# EasyEDA schematic SCH_ppc_2025-05-21.json
TITLE: Sheet_1; REV: 1.0; Date: 2025-05-20; Sheet: 1/1; Company: Your Company
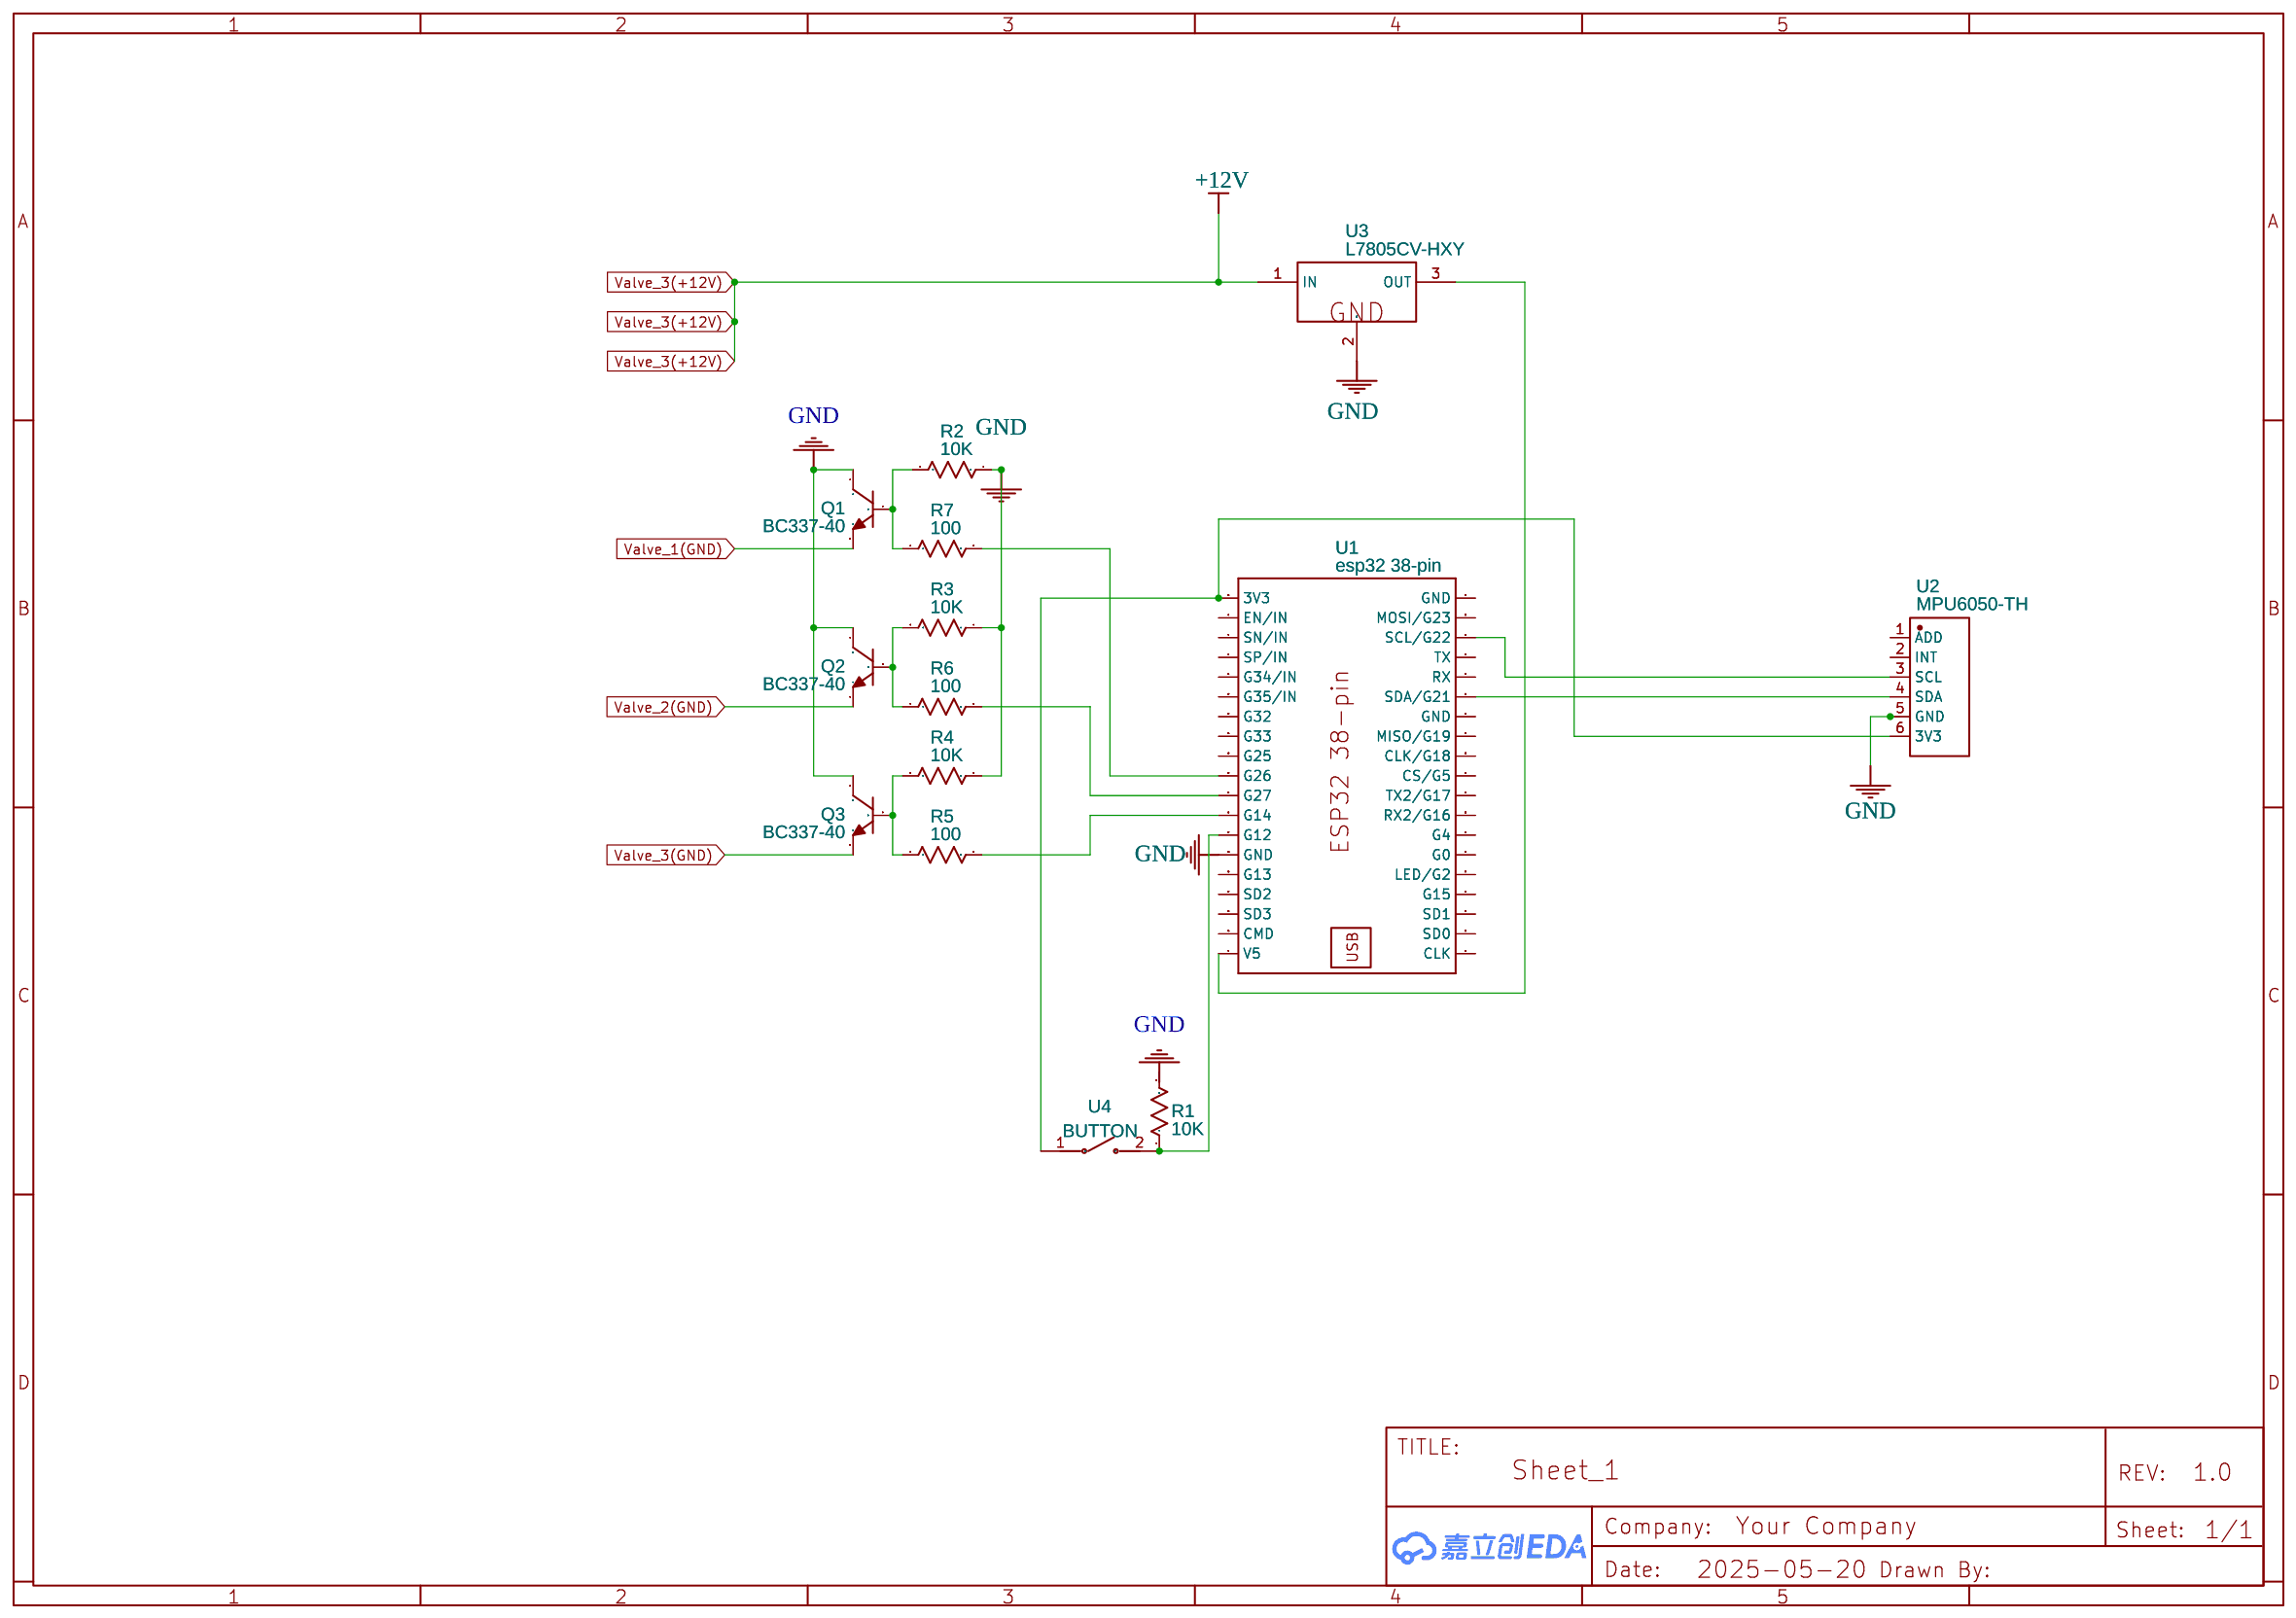
[diagram p0: schematic sheet]

## Parts
Q1  BC337-40  [TO-92-3_L4.9-W3.7-P1.27-L]
Q2  BC337-40  [TO-92-3_L4.9-W3.7-P1.27-L]
Q3  BC337-40  [TO-92-3_L4.9-W3.7-P1.27-L]
R1  10K  [PKG-0.25W RESISTOR]
R2  10K  [PKG-0.25W RESISTOR]
R3  10K  [PKG-0.25W RESISTOR]
R4  10K  [PKG-0.25W RESISTOR]
R5  100  [PKG-0.25W RESISTOR]
R6  100  [PKG-0.25W RESISTOR]
R7  100  [PKG-0.25W RESISTOR]
U1  esp32 38-pin  [ESP32 38-PIN]
U2  MPU6050-TH  [COMM-TH_MPU6050-TH]
U3  L7805CV-HXY  [TO-220-3_L10.0-W4.5-P2.54-L]
U4  BUTTON  [SW-SMD_L3.9-W2.9-LS4.9-L]

## Library data of the parts
Q1-Q3 = BC337-40: Contributor: LCSC; Supplier: LCSC; Supplier Part: C713611; Manufacturer: LGE(鲁光); JLCPCB Part Class: Extended Part
R1-R4 = 10K: Power: 1/4W; Tolerance: ±5%; Supplier Part: 9339116; Supplier: Element14; Manufacturer: MULTICOMP; Manufacturer Part: MCF 0.25W 10K; Link: http://www.farnell.com/datasheets/1716725.pdf?_ga=2.130313612.2023696496.1506695686-238689616.1505921947&_gac=1.45287312.1506011718.EAIaIQobChMI57GX6tq21gIVTzobCh2WXgT2EAAYASAAEgKn9_D_BwE; Contributor: Prof. Ing. F. Scordino
R5-R7 = 100: Power: 1/4W; Tolerance: ±5%; Supplier Part: 9339116; Supplier: Element14; Manufacturer: MULTICOMP; Manufacturer Part: MCF 0.25W 10K; Link: http://www.farnell.com/datasheets/1716725.pdf?_ga=2.130313612.2023696496.1506695686-238689616.1505921947&_gac=1.45287312.1506011718.EAIaIQobChMI57GX6tq21gIVTzobCh2WXgT2EAAYASAAEgKn9_D_BwE; Contributor: nurohman
U1 = esp32 38-pin: Supplier: self; Contributor: saadmuhammad262
U2 = MPU6050-TH: Supplier: LCSC; Supplier Part: C9900132629; Manufacturer: null; Contributor: lcsc
U3 = L7805CV-HXY: Contributor: lcsc; Supplier: LCSC; Supplier Part: C7469132; Manufacturer: HXY MOSFET(华轩阳电子); JLCPCB Part Class: Extended Part
U4 = BUTTON: Contributor: lcsc; Supplier: LCSC; Supplier Part: C9900015607; Manufacturer: null; JLCPCB Part Class: Extended Part

## Nets
+12V: U3.1(IN)
GND: Q1.1(C) Q2.1(C) Q3.1(C) R1.2 R2.1 R3.1 R4.1 U1.GND2(GND) U2.5(GND) U3.2(GND)
Valve_1(GND): Q1.3(E)
Valve_2(GND): Q2.3(E)
Valve_3(GND): Q3.3(E)
Net-(Q1-2): Q1.2(B) R2.2 R7.1
Net-(Q2-2): Q2.2(B) R3.2 R6.1
Net-(Q3-2): Q3.2(B) R4.2 R5.1
Net-(R1-1): R1.1 U1.D12(G12) U4.2
Net-(R5-2): R5.2 U1.D14(G14)
Net-(R6-2): R6.2 U1.D27(G27)
Net-(R7-2): R7.2 U1.D26(G26)
Net-(U1-3V3): U1.3V3 U2.6(3V3) U4.1
Net-(U1-D21): U1.D21(SDA/G21) U2.4(SDA)
Net-(U1-D22): U1.D22(SCL/G22) U2.3(SCL)
Net-(U1-V5): U1.V5 U3.3(OUT)

Not connected (* = marked no-connect by the designer): U1 CLK CMD D0(G0) D2(LED/G2) D4(G4) D5(CS/G5) D13(G13) D15(G15) D16(RX2/G16) D17(TX2/G17) D18(CLK/G18) D19(MISO/G19) D23(MOSI/G23) D25(G25) D32(G32) D33(G33) D34(G34/IN) D35(G35/IN) EN(EN/IN) GND GND1(GND) RX SD0 SD1 SD2 SD3 TX VN(SP/IN) VP(SN/IN); U2 1(ADD) 2(INT)
